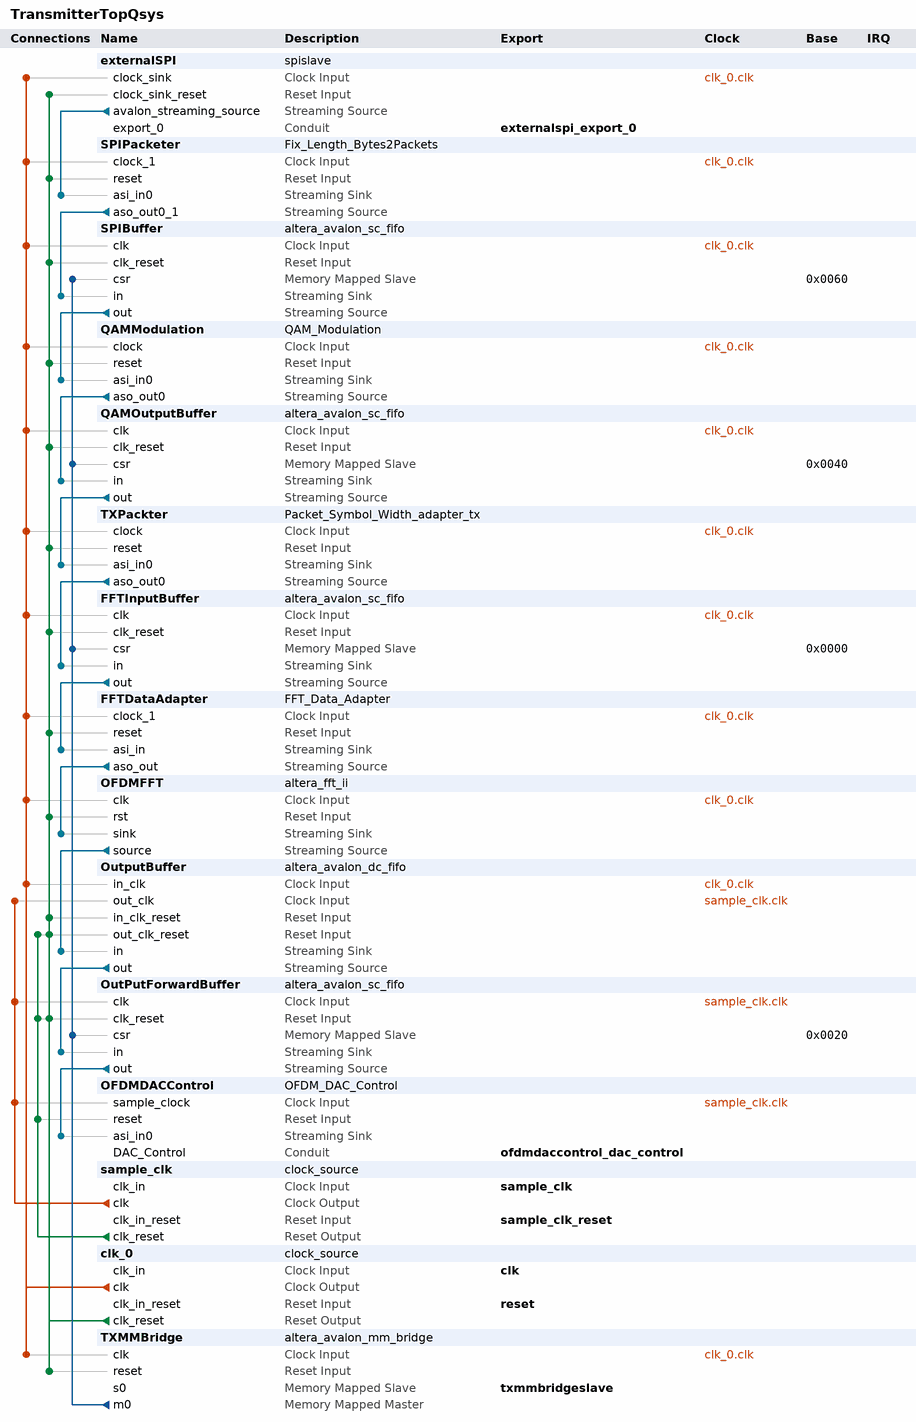
[diagram p0: system contents]
# Platform Designer (Qsys) system TransmitterTopQsys, Cyclone V 5CSXFC6D6F31C6
# Parameters at their usual value, and those the tool derives, are not listed.
package require -exact qsys 16.1
create_system TransmitterTopQsys
set_project_property DEVICE_FAMILY {Cyclone V}
set_project_property DEVICE 5CSXFC6D6F31C6

add_instance externalSPI spislave 16.1
set_instance_parameter_value externalSPI SYNC_DEPTH 2

add_instance SPIPacketer Fix_Length_Bytes2Packets 1.0
set_instance_parameter_value SPIPacketer BITS_PER_BYTES 8
set_instance_parameter_value SPIPacketer BYTES_PER_SYMBOL 1
set_instance_parameter_value SPIPacketer SYMBOL_PER_PACKET 16

add_instance SPIBuffer altera_avalon_sc_fifo 16.1
set_instance_parameter_value SPIBuffer BITS_PER_SYMBOL 8
set_instance_parameter_value SPIBuffer CHANNEL_WIDTH 0
set_instance_parameter_value SPIBuffer ERROR_WIDTH 0
set_instance_parameter_value SPIBuffer FIFO_DEPTH 16384
set_instance_parameter_value SPIBuffer USE_FILL_LEVEL 1
set_instance_parameter_value SPIBuffer USE_MEMORY_BLOCKS 1
set_instance_parameter_value SPIBuffer USE_PACKETS 1
set_instance_parameter_value SPIBuffer USE_STORE_FORWARD 1

add_instance QAMModulation QAM_Modulation 1.0
set_instance_parameter_value QAMModulation MOD_OUT_WIDTH 2
set_instance_parameter_value QAMModulation PIPELINE_DEEPTH 4
set_instance_parameter_value QAMModulation QAM_STAGE 4

add_instance QAMOutputBuffer altera_avalon_sc_fifo 16.1
set_instance_parameter_value QAMOutputBuffer BITS_PER_SYMBOL 16
set_instance_parameter_value QAMOutputBuffer CHANNEL_WIDTH 0
set_instance_parameter_value QAMOutputBuffer ERROR_WIDTH 0
set_instance_parameter_value QAMOutputBuffer FIFO_DEPTH 8192
set_instance_parameter_value QAMOutputBuffer USE_FILL_LEVEL 1
set_instance_parameter_value QAMOutputBuffer USE_MEMORY_BLOCKS 1
set_instance_parameter_value QAMOutputBuffer USE_PACKETS 1
set_instance_parameter_value QAMOutputBuffer USE_STORE_FORWARD 1

add_instance TXPackter Packet_Symbol_Width_adapter_tx 1.0
set_instance_parameter_value TXPackter INPUT_SYMBOL_WIDTH 16
set_instance_parameter_value TXPackter OUTPUT_SYMBOL_WIDTH 4

add_instance FFTInputBuffer altera_avalon_sc_fifo 16.1
set_instance_parameter_value FFTInputBuffer BITS_PER_SYMBOL 4
set_instance_parameter_value FFTInputBuffer CHANNEL_WIDTH 0
set_instance_parameter_value FFTInputBuffer ERROR_WIDTH 0
set_instance_parameter_value FFTInputBuffer FIFO_DEPTH 8192
set_instance_parameter_value FFTInputBuffer USE_FILL_LEVEL 1
set_instance_parameter_value FFTInputBuffer USE_MEMORY_BLOCKS 1
set_instance_parameter_value FFTInputBuffer USE_PACKETS 1
set_instance_parameter_value FFTInputBuffer USE_STORE_FORWARD 1

add_instance FFTDataAdapter FFT_Data_Adapter 1.0
set_instance_parameter_value FFTDataAdapter EXTRA_LEFT_PADDING 5
set_instance_parameter_value FFTDataAdapter EXTRA_RIGHT_PADDING 9
set_instance_parameter_value FFTDataAdapter INPUT_SYMBOL_WIDTH 2
set_instance_parameter_value FFTDataAdapter INVERSE_FFT 1

add_instance OFDMFFT altera_fft_ii 16.1
set_instance_parameter_value OFDMFFT data_flow Streaming
set_instance_parameter_value OFDMFFT data_rep {Block Floating Point}
set_instance_parameter_value OFDMFFT engine_arch {Quad Output}
set_instance_parameter_value OFDMFFT in_width 16
set_instance_parameter_value OFDMFFT length 64
set_instance_parameter_value OFDMFFT out_order Natural
set_instance_parameter_value OFDMFFT out_width 29
set_instance_parameter_value OFDMFFT twid_width 16

add_instance OutputBuffer altera_avalon_dc_fifo 16.1
set_instance_parameter_value OutputBuffer BITS_PER_SYMBOL 38
set_instance_parameter_value OutputBuffer FIFO_DEPTH 4096
set_instance_parameter_value OutputBuffer USE_PACKETS 1

add_instance OutPutForwardBuffer altera_avalon_sc_fifo 16.1
set_instance_parameter_value OutPutForwardBuffer BITS_PER_SYMBOL 38
set_instance_parameter_value OutPutForwardBuffer CHANNEL_WIDTH 0
set_instance_parameter_value OutPutForwardBuffer ERROR_WIDTH 0
set_instance_parameter_value OutPutForwardBuffer FIFO_DEPTH 8192
set_instance_parameter_value OutPutForwardBuffer USE_FILL_LEVEL 1
set_instance_parameter_value OutPutForwardBuffer USE_MEMORY_BLOCKS 1
set_instance_parameter_value OutPutForwardBuffer USE_PACKETS 1
set_instance_parameter_value OutPutForwardBuffer USE_STORE_FORWARD 1

add_instance OFDMDACControl OFDM_DAC_Control 1.0

add_instance sample_clk clock_source 16.1
set_instance_parameter_value sample_clk clockFrequency 10000000

add_instance clk_0 clock_source 16.1
set_instance_parameter_value clk_0 clockFrequency 100000000

add_instance TXMMBridge altera_avalon_mm_bridge 16.1
set_instance_parameter_value TXMMBridge ADDRESS_UNITS SYMBOLS
set_instance_parameter_value TXMMBridge ADDRESS_WIDTH 10
set_instance_parameter_value TXMMBridge DATA_WIDTH 32
set_instance_parameter_value TXMMBridge MAX_PENDING_RESPONSES 4
set_instance_parameter_value TXMMBridge USE_AUTO_ADDRESS_WIDTH 1

# connections
add_connection clk_0.clk externalSPI.clock_sink clock
add_connection clk_0.clk FFTDataAdapter.clock_1 clock
add_connection clk_0.clk FFTInputBuffer.clk clock
add_connection clk_0.clk OFDMFFT.clk clock
add_connection clk_0.clk OutputBuffer.in_clk clock
add_connection clk_0.clk QAMModulation.clock clock
add_connection clk_0.clk QAMOutputBuffer.clk clock
add_connection clk_0.clk SPIBuffer.clk clock
add_connection clk_0.clk SPIPacketer.clock_1 clock
add_connection clk_0.clk TXMMBridge.clk clock
add_connection clk_0.clk TXPackter.clock clock
add_connection sample_clk.clk OFDMDACControl.sample_clock clock
add_connection sample_clk.clk OutputBuffer.out_clk clock
add_connection sample_clk.clk OutPutForwardBuffer.clk clock
add_connection clk_0.clk_reset externalSPI.clock_sink_reset reset
add_connection clk_0.clk_reset FFTDataAdapter.reset reset
add_connection clk_0.clk_reset FFTInputBuffer.clk_reset reset
add_connection clk_0.clk_reset OFDMFFT.rst reset
add_connection clk_0.clk_reset OutputBuffer.in_clk_reset reset
add_connection clk_0.clk_reset OutputBuffer.out_clk_reset reset
add_connection clk_0.clk_reset OutPutForwardBuffer.clk_reset reset
add_connection clk_0.clk_reset QAMModulation.reset reset
add_connection clk_0.clk_reset QAMOutputBuffer.clk_reset reset
add_connection clk_0.clk_reset SPIBuffer.clk_reset reset
add_connection clk_0.clk_reset SPIPacketer.reset reset
add_connection clk_0.clk_reset TXMMBridge.reset reset
add_connection clk_0.clk_reset TXPackter.reset reset
add_connection sample_clk.clk_reset OFDMDACControl.reset reset
add_connection sample_clk.clk_reset OutputBuffer.out_clk_reset reset
add_connection sample_clk.clk_reset OutPutForwardBuffer.clk_reset reset
add_connection TXMMBridge.m0 FFTInputBuffer.csr avalon
set_connection_parameter_value TXMMBridge.m0/FFTInputBuffer.csr baseAddress 0x0000
add_connection TXMMBridge.m0 OutPutForwardBuffer.csr avalon
set_connection_parameter_value TXMMBridge.m0/OutPutForwardBuffer.csr baseAddress 0x0020
add_connection TXMMBridge.m0 QAMOutputBuffer.csr avalon
set_connection_parameter_value TXMMBridge.m0/QAMOutputBuffer.csr baseAddress 0x0040
add_connection TXMMBridge.m0 SPIBuffer.csr avalon
set_connection_parameter_value TXMMBridge.m0/SPIBuffer.csr baseAddress 0x0060
add_connection externalSPI.avalon_streaming_source SPIPacketer.asi_in0 avalon_streaming
add_connection FFTDataAdapter.aso_out OFDMFFT.sink avalon_streaming
add_connection FFTInputBuffer.out FFTDataAdapter.asi_in avalon_streaming
add_connection OFDMFFT.source OutputBuffer.in avalon_streaming
add_connection OutputBuffer.out OutPutForwardBuffer.in avalon_streaming
add_connection OutPutForwardBuffer.out OFDMDACControl.asi_in0 avalon_streaming
add_connection QAMModulation.aso_out0 QAMOutputBuffer.in avalon_streaming
add_connection QAMOutputBuffer.out TXPackter.asi_in0 avalon_streaming
add_connection SPIBuffer.out QAMModulation.asi_in0 avalon_streaming
add_connection SPIPacketer.aso_out0_1 SPIBuffer.in avalon_streaming
add_connection TXPackter.aso_out0 FFTInputBuffer.in avalon_streaming

# exported interfaces
add_interface clk clock sink
set_interface_property clk EXPORT_OF clk_0.clk_in
add_interface externalspi_export_0 conduit end
set_interface_property externalspi_export_0 EXPORT_OF externalSPI.export_0
add_interface ofdmdaccontrol_dac_control conduit end
set_interface_property ofdmdaccontrol_dac_control EXPORT_OF OFDMDACControl.DAC_Control
add_interface reset reset sink
set_interface_property reset EXPORT_OF clk_0.clk_in_reset
add_interface sample_clk clock sink
set_interface_property sample_clk EXPORT_OF sample_clk.clk_in
add_interface sample_clk_reset reset sink
set_interface_property sample_clk_reset EXPORT_OF sample_clk.clk_in_reset
add_interface txmmbridgeslave avalon slave
set_interface_property txmmbridgeslave EXPORT_OF TXMMBridge.s0

set_interconnect_requirement {$system} qsys_mm.clockCrossingAdapter HANDSHAKE
set_interconnect_requirement {$system} qsys_mm.enableEccProtection FALSE
set_interconnect_requirement {$system} qsys_mm.insertDefaultSlave FALSE
set_interconnect_requirement {$system} qsys_mm.maxAdditionalLatency 1

save_system TransmitterTopQsys.qsys
